# EAGLE design PT (EAGLE 6.6.0)
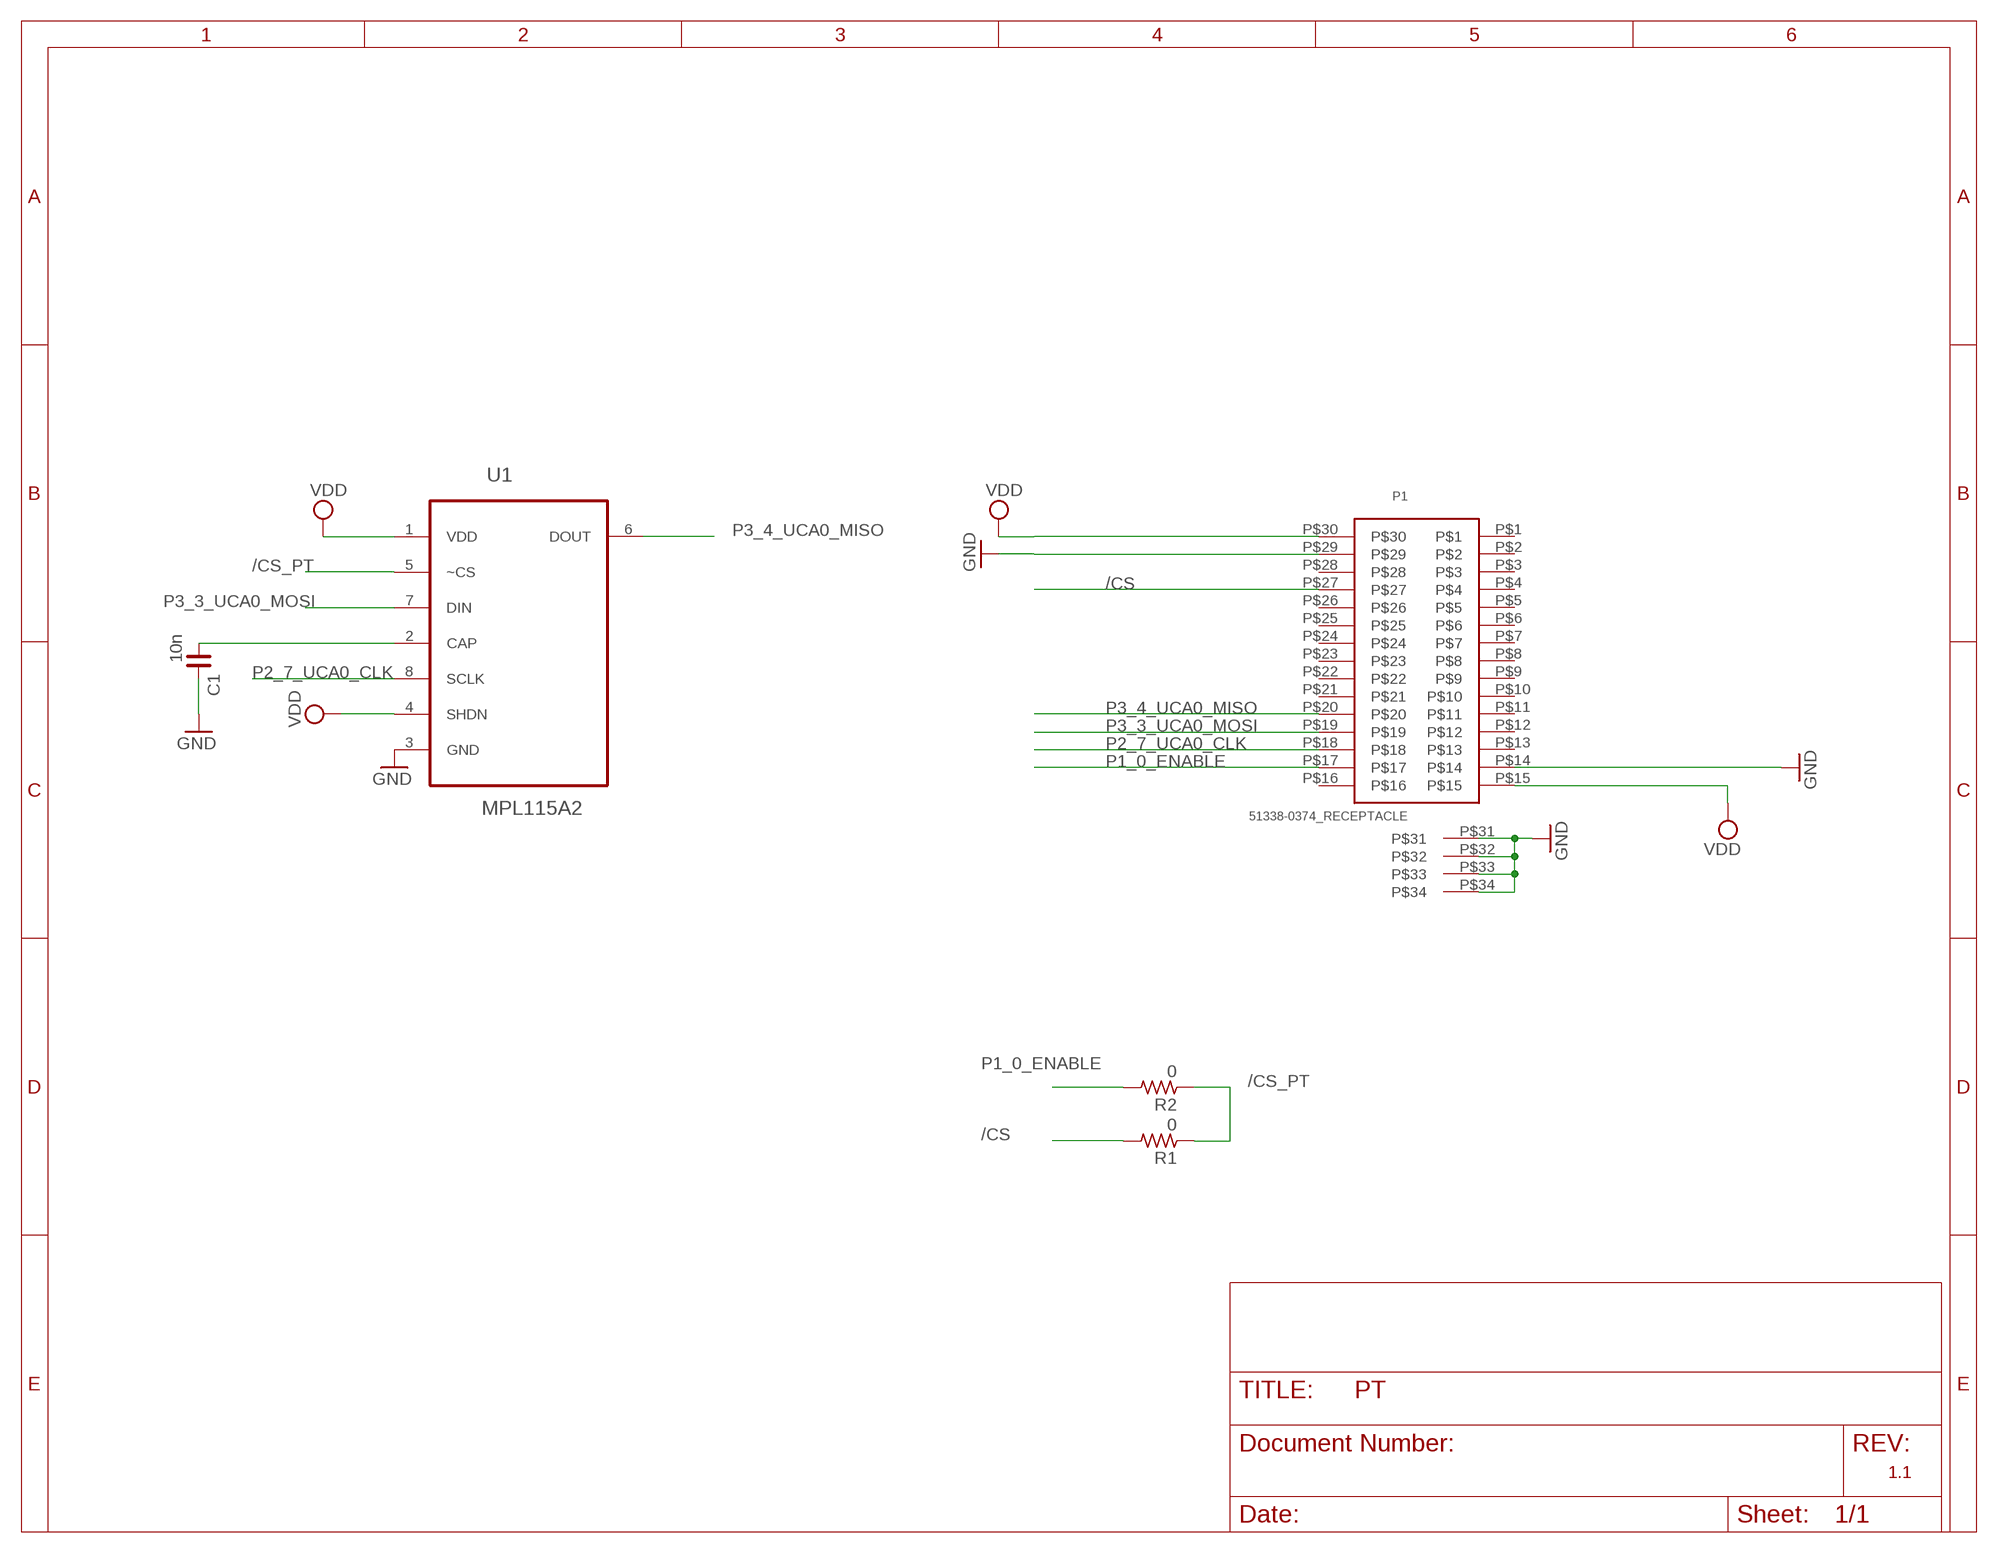
[diagram p0: schematic, sheet 1]

## Parts
C1  10n  C_0402  [C0402]
P1  51338-0374_RECEPTACLE  [51338-0374_RECEPTACLE]
R1  0  R_0402  [R0402]
R2  0  R_0402  [R0402]
U1  MPL115A2  [LGA8R125P0X4_500X300X120]

## Nets
/CS: P1.P$27 R1.2
/CS_PT: R1.1 R2.1 U1.5(~CS)
GND: C1.2 P1.P$14 P1.P$29 P1.P$31 P1.P$32 P1.P$33 P1.P$34 U1.3(GND)
N$1: C1.1 U1.2(CAP)
P1_0_ENABLE: P1.P$17 R2.2
P2_7_UCA0_CLK: P1.P$18 U1.8(SCLK)
P3_3_UCA0_MOSI: P1.P$19 U1.7(DIN)
P3_4_UCA0_MISO: P1.P$20 U1.6(DOUT)
VDD: P1.P$15 P1.P$30 U1.1(VDD) U1.4(SHDN)
Unconnected: P1.P$1 P1.P$2 P1.P$3 P1.P$4 P1.P$5 P1.P$6 P1.P$7 P1.P$8 P1.P$9 P1.P$10 P1.P$11 P1.P$12 P1.P$13 P1.P$16 P1.P$21 P1.P$22 P1.P$23 P1.P$24 P1.P$25 P1.P$26 P1.P$28

## Notes on the sheet
- 1.1

## Library data of the parts
C1 = rc-master-smd:C_: NON-POLARIZED CAP
P1 = Molex_SlimStack:51338-0374_RECEPTACLE
R1 R2 = rc-master-smd:R_: RESISTOR
U1 = MPL115A1:MPL115A2: Miniature SPI Digital Barometer; MPN: MPL115A2; OC_FARNELL: 1871577; OC_NEWARK: 69R5779; PACKAGESTYLE: LGA-8; SUPPLIER: Freescale

## Board
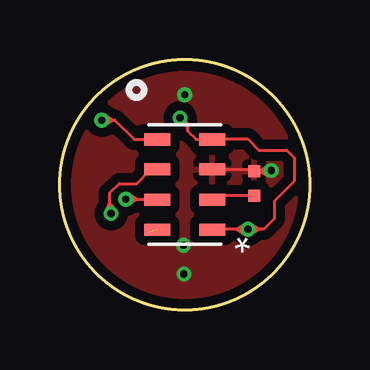
[diagram p1: board, top side]
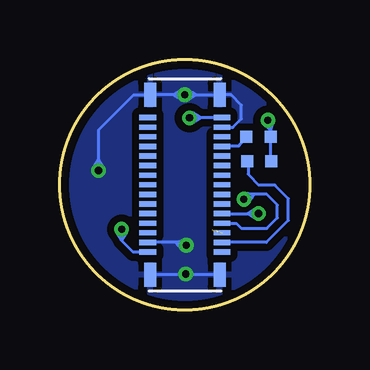
[diagram p2: board, bottom side, seen from below]

Size 10.4 x 10.4 mm. Coordinates in mm from the lower left corner, seen from the top.
Outline: circle at 5.2,5.2 radius 5.2
Copper layers (1*16): Top 0.035mm / dielectric 1.5mm / Bottom 0.035mm
Design rules "DIRTY_PCB *": minimum track width 5mil, minimum drill 12mil, track to track 5mil, track to pad 5mil, pad to pad 5mil, via to via 5mil, smd to smd 0mil, copper to edge 10mil, drill to drill 10mil, minimum pad ring 10mil, minimum via ring 6mil, stop-mask expansion 0mil, vias tented up to drill 25mil, thermal gap 10mil

### Footprints (pad centres in the part's own frame; a part is rotated, then mirrored left to right if it is on the bottom)
C0402 = smd 0.5 x 0.5: 1 -0.508,0; 2 0.508,0
51338-0374_RECEPTACLE = smd 0.7 x 0.22: P$1 -1.55,2.8; P$2 -1.55,2.4; P$3 -1.55,2; P$4 -1.55,1.6; P$5 -1.55,1.2; P$6 -1.55,0.8; P$7 -1.55,0.4; P$8 -1.55,0; P$9 -1.55,-0.4; P$10 -1.55,-0.8; P$11 -1.55,-1.2; P$12 -1.55,-1.6; P$13 -1.55,-2; P$14 -1.55,-2.4; P$15 -1.55,-2.8; P$16 1.55,-2.8; P$17 1.55,-2.4; P$18 1.55,-2; P$19 1.55,-1.6; P$20 1.55,-1.2; P$21 1.55,-0.8; P$22 1.55,-0.4; P$23 1.55,0; P$24 1.55,0.4; P$25 1.55,0.8; P$26 1.55,1.2; P$27 1.55,1.6; P$28 1.55,2; P$29 1.55,2.4; P$30 1.55,2.8 | smd 0.5 x 1: P$31 1.45,3.75; P$32 -1.45,3.75; P$33 -1.45,-3.75; P$34 1.45,-3.75
R0402 = smd 0.5 x 0.5: 1 -0.508,0; 2 0.508,0
LGA8R125P0X4_500X300X120 = smd 1.092 x 0.508: 1 -1.143,1.88; 2 -1.143,0.635; 3 -1.143,-0.635; 4 -1.143,-1.88; 5 1.143,-1.88; 6 1.143,-0.635; 7 1.143,0.635; 8 1.143,1.88

### Placement (x,y rotation side)
C1  8.09,5.26 90 top
P1  5.2,5.2 0 bottom
R1  2.13,7.21 180 bottom
R2  2.1,6.18 180 bottom
U1  5.2,5.21 180 top

### Tracks (layer width: path | path; a pad name or v marks a point on that pad's centre or on a via)
/CS
  Bottom 0.127: R1.2 2.95,6.81 P1.P$27
/CS_PT  (via drill 0.3)
  Top 0.127: v1.74,7.89 2.2,7.89 | 2.2,7.89 2.29,7.89 3.09,7.09 U1.5 | 2.2,7.89 1.87,8.1 v1.74,7.89 | 2.2,7.89 1.87,7.69 v1.74,7.89
  Bottom 0.127: R2.1 1.62,6.18 R1.1 1.62,7.45 | 1.62,7.45 1.62,7.77 v1.74,7.89 | 1.62,7.45 1.91,7.71 v1.74,7.89 | 1.62,7.45 1.51,7.82 v1.74,7.89
GND  (via drill 0.3)
  Top 0.127: U1.3 8.09,5.85 C1.2 8.34,5.77 | v8.8,5.79 8.78,5.77 8.34,5.77 | 8.34,5.77 8.68,5.58 v8.8,5.79 | 8.34,5.77 8.66,5.99 v8.8,5.79
  Bottom 0.127: P1.P$34 P1.P$33 | 6.72,2.79 6.73,2.78 P1.P$14 5.58,2.8 | P1.P$29 3.2,7.59 2.84,7.95 2.84,8.52 3.27,8.95 P1.P$31 4.74,8.95 | v5.2,8.95 5.66,8.95 | 5.66,8.95 P1.P$32 7.34,8.94 8.8,7.48 8.8,6.25 | 8.8,6.25 v8.8,5.79 | v5.14,2.68 5.26,2.8 5.58,2.8 | v5.2,8.95 4.74,8.95 | 8.8,6.25 8.6,5.92 v8.8,5.79 | 8.8,6.25 9.01,5.92 v8.8,5.79 | 5.66,8.95 5.33,9.16 v5.2,8.95 | 5.66,8.95 5.33,8.75 v5.2,8.95 | 4.74,8.95 5.07,8.75 v5.2,8.95 | 4.74,8.95 5.07,9.16 v5.2,8.95 | 5.58,2.8 5.21,2.91 v5.14,2.68 | 5.58,2.8 5.32,2.52 v5.14,2.68
  other vias: 5.16,1.48
  pour Top (isolate 0.381): 0.2,5.2 arc-90 5.2,10.2 arc-90 10.2,5.2 arc-90 5.2,0.2 arc-90
  pour Bottom (isolate 0.305): 0.2,5.2 arc-90 5.2,10.2 arc-90 10.2,5.2 arc-90 5.2,0.2 arc-90
N$1
  Top 0.127: C1.1 6.34,4.75 U1.2
P1_0_ENABLE
  Bottom 0.127: R2.2 2.56,6.13 2.56,5.64 2.11,5.19 1.45,5.19 0.88,4.62 0.88,3.72 1.8,2.8 P1.P$17
P2_7_UCA0_CLK  (1 unrouted)
P3_3_UCA0_MOSI  (via drill 0.3)
  Top 0.127: v2.74,4.6 3.2,4.6 | 3.2,4.6 4.03,4.6 arc-90 U1.7 | 3.2,4.6 2.87,4.8 v2.74,4.6 | 3.2,4.6 2.87,4.4 v2.74,4.6
  Bottom 0.127: P1.P$19 3.05,3.59 2.84,3.38 1.78,3.38 1.34,3.82 1.34,4.36 1.79,4.81 2.33,4.81 | 2.33,4.81 2.5,4.81 2.71,4.6 v2.74,4.6 | 2.33,4.81 2.53,4.48 v2.74,4.6 | 2.33,4.81 2.72,4.84 v2.74,4.6
P3_4_UCA0_MISO  (via drill 0.3)
  Top 0.127: U1.6 3.79,5.85 3.19,5.25 2.47,5.25 2.06,4.84 2.06,4.45 | 2.06,4.45 2.06,4.07 v2.13,4 | 2.06,4.45 1.91,4.09 v2.13,4 | 2.06,4.45 2.31,4.16 v2.13,4
  Bottom 0.127: P1.P$20 2.59,4 | 2.59,4 v2.13,4 | 2.59,4 2.26,4.21 v2.13,4 | 2.59,4 2.26,3.79 v2.13,4
VDD  (via drill 0.3)
  Top 0.127: v5,7.99 5.31,7.68 5.31,7.65 | 5.31,7.65 5.31,7.45 5.67,7.09 U1.4 6.36,7.11 7.82,7.11 8.28,6.65 9.44,6.65 9.76,6.33 9.76,5.35 8.93,4.52 8.93,3.79 8.49,3.35 8.29,3.35 | v7.83,3.35 7.37,3.35 | 7.37,3.35 6.36,3.35 arc90 U1.1 | 8.29,3.35 v7.83,3.35 | 5.31,7.65 5.24,8.04 v5,7.99 | 5.31,7.65 4.94,7.76 v5,7.99 | 7.37,3.35 7.7,3.15 v7.83,3.35 | 7.37,3.35 7.7,3.56 v7.83,3.35 | 8.29,3.35 7.96,3.56 v7.83,3.35 | 8.29,3.35 7.96,3.15 v7.83,3.35
  Bottom 0.127: P1.P$30 4.54,7.99 | 4.54,7.99 v5,7.99 | P1.P$15 7.35,2.39 7.83,2.87 7.83,2.89 | 7.83,2.89 v7.83,3.35 | 4.54,7.99 4.87,7.79 v5,7.99 | 4.54,7.99 4.87,8.2 v5,7.99 | 7.83,2.89 8.04,3.22 v7.83,3.35 | 7.83,2.89 7.62,3.22 v7.83,3.35